# EAGLE design G888 (EAGLE 4.11)
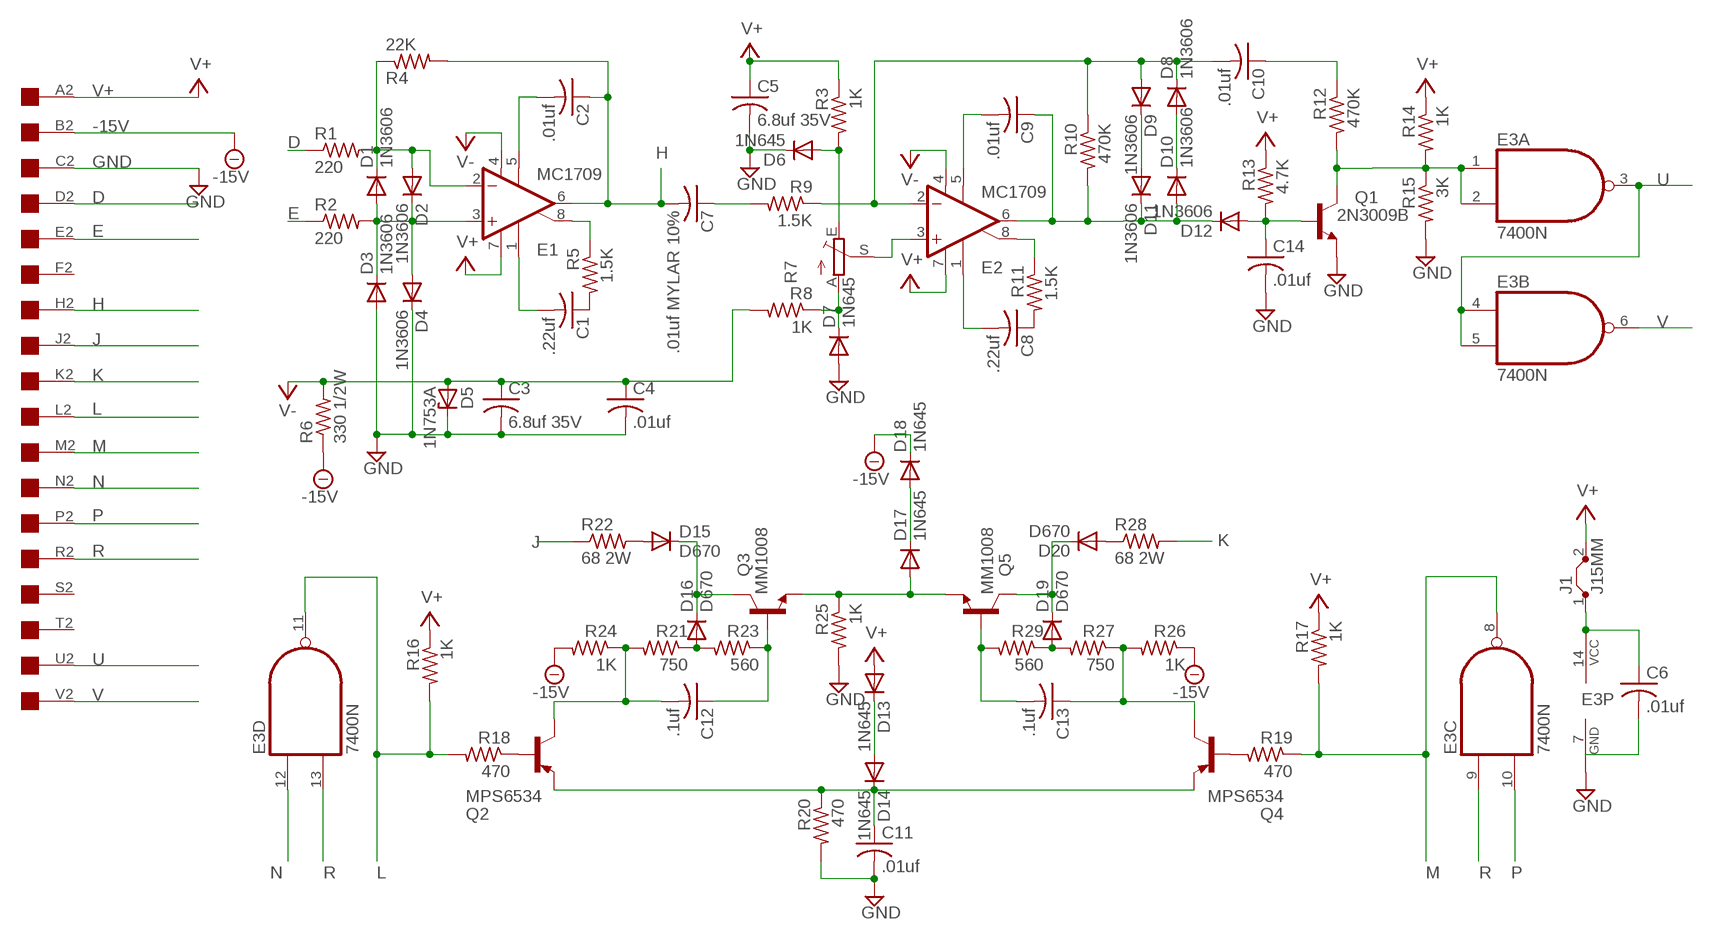
[diagram p0: schematic, sheet 1]

## Parts
C1  .22uf  C-US050-025X075  [C050-025X075]
C2  .01uf  C-US050-025X075  [C050-025X075]
C3  6.8uf 35V  C-US102-043X133  [C102-043X133]
C4  .01uf  C-US050-025X075  [C050-025X075]
C5  6.8uf 35V  C-US102-043X133  [C102-043X133]
C6  .01uf  C-US050-025X075  [C050-025X075]
C7  .01uf MYLAR 10%  C-US050-025X075  [C050-025X075]
C8  .22uf  C-US050-025X075  [C050-025X075]
C9  .01uf  C-US050-025X075  [C050-025X075]
C10  .01uf  C-US050-025X075  [C050-025X075]
C11  .01uf  C-US050-025X075  [C050-025X075]
C12  .1uf  C-US050-025X075  [C050-025X075]
C13  .1uf  C-US050-025X075  [C050-025X075]
C14  .01uf  C-US050-025X075  [C050-025X075]
D1  1N3606  1N4004  [DO41-10]
D2  1N3606  1N4004  [DO41-10]
D3  1N3606  1N4004  [DO41-10]
D4  1N3606  1N4004  [DO41-10]
D5  1N753A  ZENER-DIODEDO35Z10  [DO35Z10]
D6  1N645  1N4004  [DO41-10]
D7  1N645  1N4004  [DO41-10]
D8  1N3606  1N4004  [DO41-10]
D9  1N3606  1N4004  [DO41-10]
D10  1N3606  1N4004  [DO41-10]
D11  1N3606  1N4004  [DO41-10]
D12  1N3606  1N4004  [DO41-10]
D13  1N645  1N4004  [DO41-10]
D14  1N645  1N4004  [DO41-10]
D15  D670  1N4004  [DO41-10]
D16  D670  1N4004  [DO41-10]
D17  1N645  1N4004  [DO41-10]
D18  1N645  1N4004  [DO41-10]
D19  D670  1N4004  [DO41-10]
D20  D670  1N4004  [DO41-10]
E1  MC1709  LM3080N  [DIL08]
E2  MC1709  LM3080N  [DIL08]
E3  7400N  [DIL14]
J1  J15MM  [15]
Q1  2N3009B  -NPN-TO92  [TO92]
Q2  MPS6534  2N3906  [TO92]
Q3  MM1008  -NPN-TO92  [TO92]
Q4  MPS6534  2N3906  [TO92]
Q5  MM1008  -NPN-TO92  [TO92]
R1  220  R-US_0207/10  [0207/10]
R2  220  R-US_0207/10  [0207/10]
R3  1K  R-US_0207/10  [0207/10]
R4  22K  R-US_0207/10  [0207/10]
R5  1.5K  R-US_0207/10  [0207/10]
R6  330 1/2W  R-US_0411/15  [0411/15]
R7  TRIM_EU-PTSPIN  [PT-SPIN]
R8  1K  R-US_0207/10  [0207/10]
R9  1.5K  R-US_0207/10  [0207/10]
R10  470K  R-US_0207/10  [0207/10]
R11  1.5K  R-US_0207/10  [0207/10]
R12  470K  R-US_0207/10  [0207/10]
R13  4.7K  R-US_0207/10  [0207/10]
R14  1K  R-US_0207/10  [0207/10]
R15  3K  R-US_0207/10  [0207/10]
R16  1K  R-US_0207/10  [0207/10]
R17  1K  R-US_0207/10  [0207/10]
R18  470  R-US_0207/10  [0207/10]
R19  470  R-US_0207/10  [0207/10]
R20  470  R-US_0207/10  [0207/10]
R21  750  R-US_0207/10  [0207/10]
R22  68 2W  R-US_0922/22  [0922/22]
R23  560  R-US_0207/10  [0207/10]
R24  1K  R-US_0207/10  [0207/10]
R25  1K  R-US_0207/10  [0207/10]
R26  1K  R-US_0207/10  [0207/10]
R27  750  R-US_0207/10  [0207/10]
R28  68 2W  R-US_0922/22  [0922/22]
R29  560  R-US_0207/10  [0207/10]
U$5  ONE-SIDED  [ONE-SIDED]

## Nets
-15V: D18.C R6.1 R24.2 R26.1 U$5.B2
D: R1.1 U$5.D2
E: R2.1 U$5.E2
GND: C3.2 C4.2 C5.2 C11.2 C14.2 D3.A D4.C D5.C D6.C D7.A E3.7(P:GND) Q1.1(E) R15.2 R20.2 R25.2 U$5.C2
H: C2.1 C7.2 E1.6(OUT) R4.2 U$5.H2
J: R22.1 U$5.J2
K: R28.2 U$5.K2
L: E3.11(D:O) R16.2 R18.2 U$5.L2
M: E3.8(C:O) R17.2 R19.1 U$5.M2
N: E3.12(D:I0) U$5.N2
N$1: C1.1 R5.2
N$2: C8.1 R11.2
N$3: D1.C D2.A E1.2(-IN) R1.2 R4.1
N$4: D1.A D2.C D3.C D4.A E1.3(+IN) R2.2
N$5: C8.2 E2.1(ON1)
N$6: C1.2 E1.1(ON1)
N$7: E1.8(ON2) R5.1
N$8: C2.2 E1.5(OPT)
N$9: D6.A R3.2 R7.E
N$10: C10.2 D8.C D9.A E2.2(-IN) R9.1 R10.1
N$11: E2.3(+IN) R7.S
N$12: D7.C R7.A R8.1
N$13: E2.8(ON2) R11.1
N$14: C9.2 E2.5(OPT)
N$15: C9.1 D10.A D11.C D12.C E2.6(OUT) R10.2
N$16: C7.1 R9.2
N$17: D9.C D11.A
N$18: D8.A D10.C
N$19: C10.1 R12.1
N$20: C14.1 D12.A Q1.2(B) R13.2
N$21: E3.1(A:I0) E3.2(A:I1) Q1.3(C) R12.2 R14.2 R15.1
N$22: D17.A Q3.1(E) Q5.1(E) R25.1
N$23: C11.1 D14.C Q2.3(E) Q4.3(E) R20.1
N$24: D13.C D14.A
N$25: Q2.2(B) R18.1
N$26: Q4.2(B) R19.2
N$27: D15.A R22.2
N$28: D16.A R21.1 R23.2
N$29: C12.2 Q2.1(C) R21.2 R24.1
N$30: C12.1 Q3.2(B) R23.1
N$31: D19.A R27.2 R29.1
N$32: C13.1 Q4.1(C) R26.2 R27.1
N$33: C13.2 Q5.2(B) R29.2
N$34: D20.A R28.1
N$35: D15.C D16.C Q3.3(C)
N$36: D19.C D20.C Q5.3(C)
N$37: D17.C D18.A
N$38: C6.2
P: E3.10(C:I1) U$5.P2
R: E3.9(C:I0) E3.13(D:I1) U$5.R2
U: E3.3(A:O) E3.4(B:I0) E3.5(B:I1) U$5.U2
V: E3.6(B:O) U$5.V2
V+: C5.1 D13.A E1.7(V+) E2.7(V+) J1.2 R3.1 R13.1 R14.1 R16.1 R17.1 U$5.A2
V-: C3.1 C4.1 D5.A E1.4(V-) E2.4(V-) R6.2 R8.2
VCC: C6.1 E3.14(P:VCC) J1.1
Unconnected: U$5.F2 U$5.S2 U$5.T2

## Library data of the parts
C1-C14 = rcl:C-US: CAPACITOR, American symbol
D1-D4 D6-D20 = diode:1N4004: DIODE general purpose rectifier, 1 A
D5 = diode:ZENER-DIODE: Z-Diode
E1 E2 = linear:*3080: OP AMP
E3 = 74xx-us:74*00: Quad 2-input NAND gate
J1 = jumper:J: Bridge
Q1 Q3 Q5 = transistor:*-NPN-: NPN Transistror
Q2 Q4 = transistor-pnp:2N3906: PNP Transistor
R1-R6 R8-R29 = rcl:R-US_: RESISTOR, American symbol
R7 = pot:TRIM_EU-: POTENTIOMETER
U$5 = con-dec:ONE-SIDED: One-sided DEC Flip-Chip single card fingers

## Board
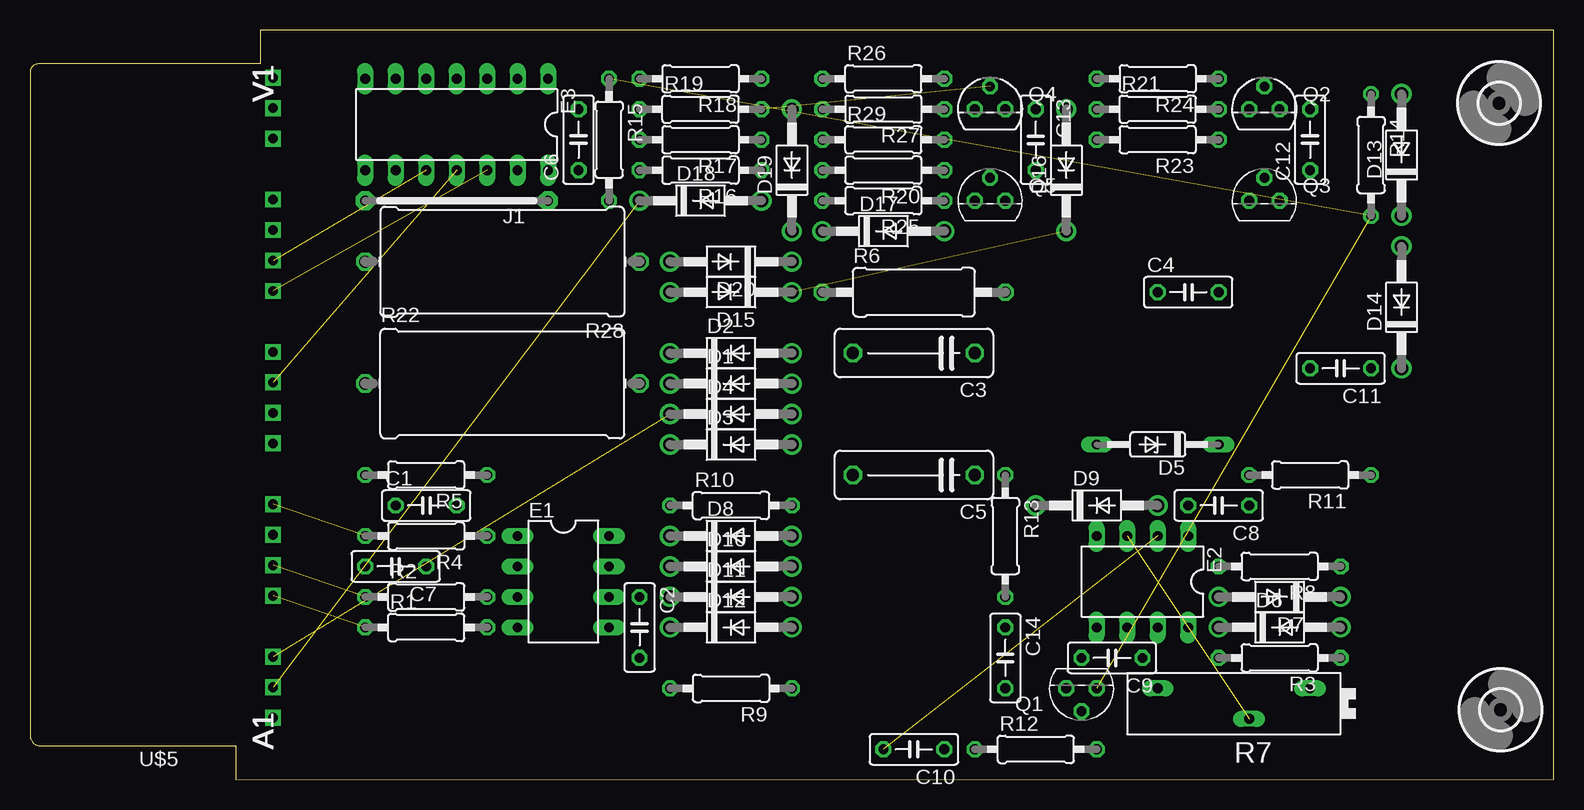
[diagram p1: board, top side]
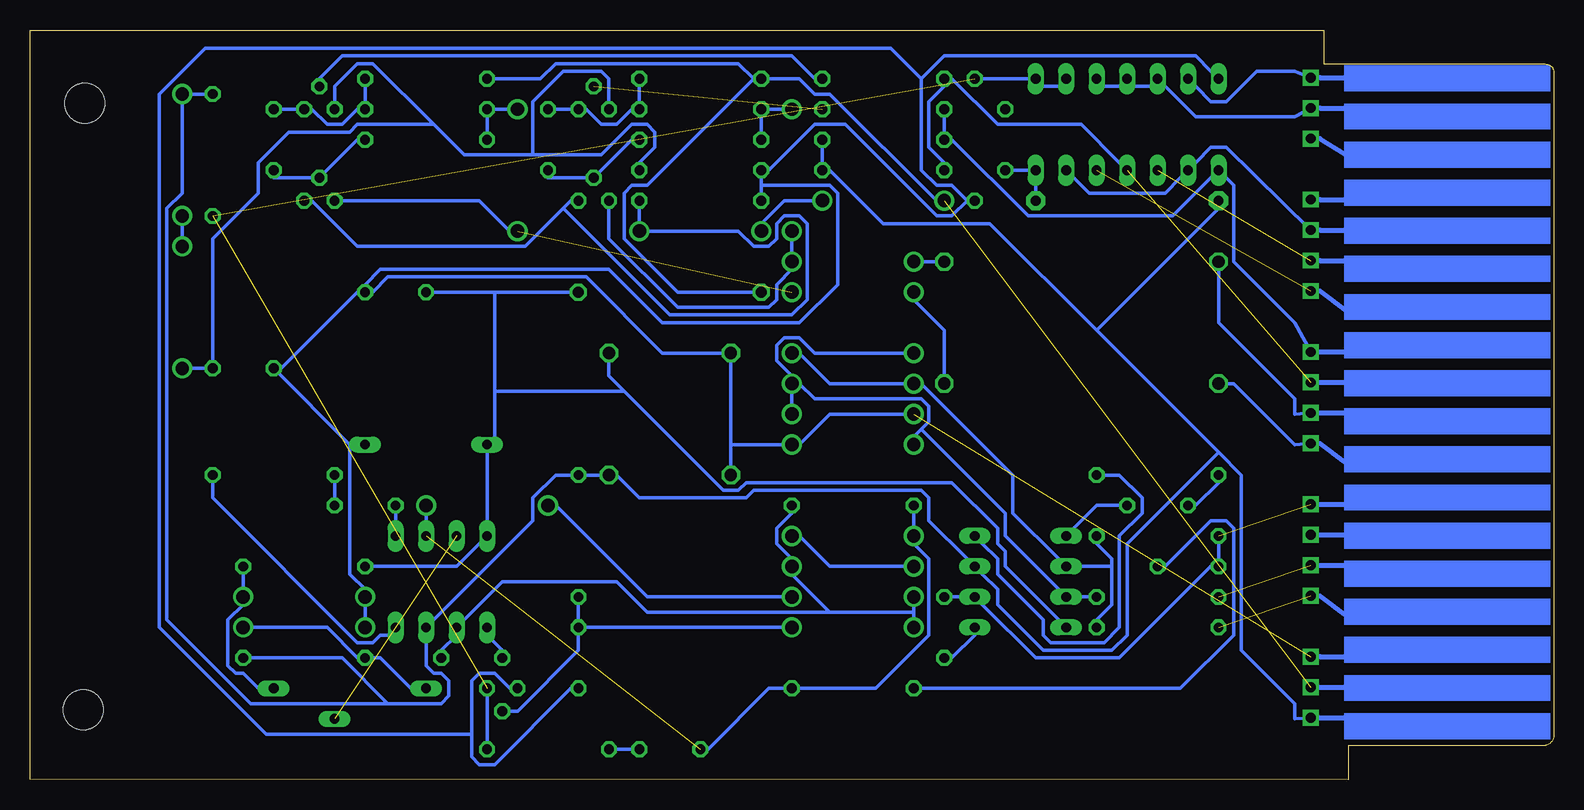
[diagram p2: board, bottom side, seen from below]

Size 126.98 x 62.48 mm. Coordinates in mm from the lower left corner, seen from the top.
Outline: 17.14,2.83 17.14,0 126.98,0.04 126.98,62.45 19.17,62.48 19.17,59.65 0.69,59.65 arc90 0,58.96 0,3.72 arc90 0.89,2.83 17.14,2.83
Copper layers (1*16): Top 0.035mm / dielectric 1.5mm / Bottom 0.035mm
Design rules "10mils": minimum track width 12mil, minimum drill 28mil, track to track 10mil, track to pad 10mil, pad to pad 10mil, via to via 10mil, smd to smd 10mil, copper to edge 40mil, drill to drill 10mil, minimum pad ring 10mil, minimum via ring 8mil, stop-mask expansion 0mil, vias tented up to drill 0mil, thermal gap 10mil

### Footprints (pad centres in the part's own frame; a part is rotated, then mirrored left to right if it is on the bottom)
C050-025X075 = drill 0.813 octagon: 1 -2.54,0; 2 2.54,0
C102-043X133 = drill 1.016 octagon: 1 -5.08,0; 2 5.08,0
DO41-10 = drill 1.118 round: A 5.08,0; C -5.08,0
DO35Z10 = drill 0.813 long: A 5.08,0; C -5.08,0
DIL08 = drill 0.813 long: 1 -3.81,-3.81; 2 -1.27,-3.81; 3 1.27,-3.81; 4 3.81,-3.81; 5 3.81,3.81; 6 1.27,3.81; 7 -1.27,3.81; 8 -3.81,3.81
DIL14 = drill 0.813 long: 1 -7.62,-3.81; 2 -5.08,-3.81; 3 -2.54,-3.81; 4 0,-3.81; 5 2.54,-3.81; 6 5.08,-3.81; 7 7.62,-3.81; 8 7.62,3.81; 9 5.08,3.81; 10 2.54,3.81; 11 0,3.81; 12 -2.54,3.81; 13 -5.08,3.81; 14 -7.62,3.81
15 = drill 0.813 pad 1.6 octagon: 1 -7.62,0; 2 7.62,0
TO92 = drill 0.813 octagon: 1 1.27,0; 2 0,1.905; 3 -1.27,0
0207/10 = drill 0.813 octagon: 1 -5.08,0; 2 5.08,0
0411/15 = drill 0.914 octagon: 1 -7.62,0; 2 7.62,0
PT-SPIN = drill 0.813 long: A -6.35,-1.27; E 6.35,-1.27; S -1.27,1.27
0922/22 = drill 1.016 octagon: 1 -11.43,0; 2 11.43,0
3,3 = hole 3.3: 0,0
ONE-SIDED = drill 0.813 square: A2 20.256,5.175; B2 20.256,7.715; C2 20.256,10.255; D2 20.256,15.335; E2 20.256,17.875; F2 20.256,20.415; H2 20.256,22.955; J2 20.256,28.035; K2 20.256,30.575; L2 20.256,33.115; M2 20.256,35.655; N2 20.256,40.735; P2 20.256,43.275; R2 20.256,45.815; S2 20.256,48.355; T2 20.256,53.435; U2 20.256,55.975; V2 20.256,58.515

### Placement (x,y rotation side)
C1  33.02,22.86 0 top
C2  50.79,12.7 270 top
C3  73.66,35.56 180 top
C4  96.52,40.64 0 top
C5  73.66,25.4 180 top
C6  45.71,53.34 90 top
C7  30.48,17.78 180 top
C8  99.06,22.86 180 top
C9  90.17,10.16 180 top
C10  73.66,2.54 180 top
C11  109.22,34.29 180 top
C12  106.68,53.34 90 top
C13  83.81,53.34 270 top
C14  81.28,10.16 270 top
D1  58.41,33.02 0 top
D2  58.41,35.56 0 top
D3  58.41,27.94 0 top
D4  58.41,30.48 0 top
D5  93.98,27.94 180 top
D6  104.14,12.7 0 top
D7  104.14,15.24 180 top
D8  58.41,20.32 0 top
D9  88.9,22.86 0 top
D10  58.41,17.78 0 top
D11  58.41,15.24 0 top
D12  58.41,12.7 0 top
D13  114.3,52.07 90 top
D14  114.3,39.37 90 top
D15  58.41,40.64 180 top
D16  86.36,50.8 90 top
D17  71.12,45.72 0 top
D18  55.88,48.26 0 top
D19  63.49,50.8 90 top
D20  58.41,43.18 180 top
E1  44.45,16.51 270 top
E2  92.7,16.51 180 top
E3  35.55,54.61 180 top
J1  35.55,48.26 180 top
Q1  87.62,7.62 180 top
Q2  102.87,55.88 0 top
Q3  102.87,48.26 0 top
Q4  80.01,55.88 0 top
Q5  80.01,48.26 0 top
R1  33.02,12.7 0 top
R2  33.02,15.24 0 top
R3  104.14,10.16 180 top
R4  33.02,20.32 180 top
R5  33.02,25.4 180 top
R6  73.66,40.64 0 top
R7  100.33,6.35 180 top
R8  104.14,17.78 180 top
R9  58.41,7.62 180 top
R10  58.41,22.86 0 top
R11  106.68,25.4 180 top
R12  83.81,2.54 0 top
R13  81.28,20.32 270 top
R14  111.76,52.07 270 top
R15  48.25,53.34 270 top
R16  55.88,50.8 180 top
R17  55.88,53.34 180 top
R18  55.88,58.42 180 top
R19  55.88,55.88 0 top
R20  71.12,50.8 180 top
R21  93.98,55.88 0 top
R22  39.36,33.02 0 top
R23  93.98,53.34 180 top
R24  93.98,58.42 180 top
R25  71.12,48.26 180 top
R26  71.12,58.42 0 top
R27  71.12,55.88 180 top
R28  39.36,43.18 180 top
R29  71.12,53.34 0 top
U$2  [3,3]  122.42,56.39 0 top
U$3  [3,3]  122.55,5.84 0 top
U$5  -0.01,0 0 top

### Tracks (layer width: path | path; a pad name or v marks a point on that pad's centre or on a via)
-15V  (1 unrouted)
  Bottom 0.305: R26.1 65.4,58.42 62.86,58.42 61.59,57.15 60.32,57.15 51.43,48.26 D18.C | 66.67,58.42 67.94,59.69 83.18,59.69 84.45,58.42 88.26,58.42 R24.2 | R26.1 66.67,58.42 | 66.67,58.42 75.56,49.53 76.83,49.53 77.47,48.9 77.47,45.09 73.02,40.64 66.67,40.64 R6.1 | R26.1 66.67,58.42
D  (1 unrouted)
E  (1 unrouted)
GND  (1 unrouted)
  Bottom 0.305: 66.04,49.53 66.04,48.9 R25.2 | 66.04,49.53 66.04,50.16 R20.2 65.4,50.8 61.59,54.61 59.05,54.61 51.43,46.99 50.16,46.99 48.89,48.26 | 68.58,27.94 68.58,34.92 C3.2 69.21,35.56 74.29,35.56 80.64,41.91 97.15,41.91 98.42,40.64 C4.2 | 68.58,27.94 68.58,26.04 C5.2 | 68.58,27.94 64.13,27.94 D3.A 62.86,27.94 60.32,30.48 53.97,30.48 D4.C | D6.C 99.06,13.34 99.06,14.61 D7.A 99.06,15.88 100.33,17.14 100.33,27.94 | 100.33,27.94 C11.2 106.04,34.29 99.69,40.64 C4.2 | 100.33,27.94 D5.C 100.33,27.94 | 90.17,3.81 90.17,8.26 89.53,8.89 88.26,8.89 86.99,7.62 Q1.1 | 90.17,3.81 90.17,1.91 89.53,1.27 88.26,1.27 81.91,7.62 C14.2 | 52.7,58.42 50.79,60.33 29.84,60.33 28.57,59.05 E3.7 | 52.7,58.42 52.7,50.8 51.43,49.53 50.16,49.53 48.89,48.26 | 48.89,48.26 R15.2 48.89,48.26 | 90.17,3.81 107.31,3.81 116.2,12.7 116.2,57.15 112.39,60.96 55.24,60.96 52.7,58.42 | 66.04,49.53 60.32,49.53 59.68,48.9 59.68,41.27 62.86,38.1 74.29,38.1 78.73,42.55 97.79,42.55 99.06,41.27 C4.2
H  (1 unrouted)
  Bottom 0.305: R4.2 27.94,19.68 27.94,18.41 C7.2 28.57,17.78 36.19,10.16 43.17,10.16 47.62,14.61 E1.6 49.52,15.24 50.16,15.24 C2.1
J
  Bottom 0.305: U$5.J2 21.59,27.94 26.67,33.02 27.3,33.02 R22.1
K
  Bottom 0.305: U$5.K2 21.59,30.48 21.59,31.75 27.94,38.1 27.94,42.55 R28.2
L  (1 unrouted)
  Bottom 0.305: E3.11 36.19,51.44 39.36,54.61 46.35,54.61 50.16,58.42 R18.2 50.79,57.78 52.06,56.52 52.06,52.7 50.79,51.44 R16.2
M
  Bottom 0.305: R19.1 50.79,55.24 50.79,53.98 R17.2 50.16,53.34 43.81,46.99 31.75,46.99 28.57,50.16 E3.8 27.3,50.16 26.67,49.53 26.67,43.18 21.59,38.1 U$5.M2
N  (1 unrouted)
N$1
  Bottom 0.305: C1.1 29.84,22.86 27.94,24.77 R5.2
N$2
  Bottom 0.305: C8.1 101.59,23.5 101.59,24.77 R11.2
N$3
  Bottom 0.305: 36.82,17.78 36.82,18.41 38.09,19.68 R4.1 | 36.82,17.78 36.82,14.61 38.09,13.34 R1.2 | 36.82,17.78 39.36,17.78 E1.2 41.27,18.41 45.08,22.23 45.08,25.4 52.7,33.02 D1.C 53.97,33.02 60.32,33.02 62.86,35.56 D2.A
N$4
  Bottom 0.305: R2.2 38.73,15.24 39.36,15.24 E1.3 41.27,15.88 45.71,20.32 45.71,22.23 52.7,29.21 | 52.7,29.21 52.06,29.84 52.06,31.11 52.7,31.75 61.59,31.75 62.86,33.02 D1.A | 52.7,29.21 53.34,28.57 D3.C | D2.C 53.97,35.56 61.59,35.56 62.86,36.83 64.13,36.83 64.77,36.2 64.77,34.92 63.49,33.66 D1.A | D4.A 63.49,31.11 63.49,32.38 D1.A
N$5
  Bottom 0.305: E2.1 96.52,21.59 96.52,22.23 C8.2
N$6
  Bottom 0.305: C1.2 36.19,22.86 38.09,22.86 40,20.95 E1.1
N$7
  Bottom 0.305: E1.8 47.62,19.68 46.35,18.41 46.35,17.14 42.54,13.34 42.54,12.06 41.9,11.43 37.46,11.43 36.19,12.7 36.19,20.32 34.28,22.23 34.28,23.5 36.19,25.4 37.46,25.4 R5.1
N$8
  Bottom 0.305: C2.2 50.16,10.16 48.25,12.06 E1.5
N$9
  Bottom 0.305: R7.E 95.25,7.62 97.79,10.16 98.42,10.16 R3.2 99.69,10.16 102.23,12.7 108.58,12.7 D6.A
N$10  (1 unrouted)
  Bottom 0.305: R10.1 53.34,22.23 53.34,20.95 D8.C 53.34,19.68 52.06,18.41 52.06,12.06 56.51,7.62 62.86,7.62 R9.1 64.13,7.62 65.4,7.62 70.48,2.54 C10.2 | E2.2 93.98,21.59 93.98,22.23 D9.A
N$11  (1 unrouted)
N$12
  Bottom 0.305: R7.A 107.95,7.62 109.22,8.89 109.85,8.89 110.48,9.53 110.48,13.34 109.22,14.61 D7.C 109.22,15.88 109.22,17.14 R8.1
N$13
  Bottom 0.305: E2.8 97.15,12.06 97.79,12.06 98.42,11.43 99.69,11.43 111.76,23.5 111.76,24.77 R11.1
N$14
  Bottom 0.305: C9.2 87.62,10.79 88.9,12.06 E2.5
N$15
  Bottom 0.305: R10.2 63.49,22.23 64.77,20.95 64.77,19.68 63.49,18.41 D10.A 63.49,17.14 60.32,13.97 | C9.1 92.7,10.79 91.44,12.06 E2.6 90.8,13.34 87.62,16.51 78.1,16.51 75.56,13.97 60.32,13.97 | 53.34,13.97 53.34,14.61 D11.C | 53.34,13.97 53.34,13.34 D12.C | 53.34,13.97 60.32,13.97
N$16
  Bottom 0.305: C7.1 32.38,17.78 28.57,21.59 27.3,21.59 26.67,20.95 26.67,12.06 31.11,7.62 52.7,7.62 R9.2
N$17
  Bottom 0.305: D11.A 64.13,15.24 75.56,15.24 83.18,22.86 D9.C
N$18
  Bottom 0.305: D10.C 53.97,17.78 60.32,17.78 62.86,20.32 D8.A
N$19
  Bottom 0.305: C10.1 76.83,2.54 78.1,2.54 R12.1
N$20
  Bottom 0.305: C14.1 81.28,13.34 81.28,14.61 R13.2 | Q1.2 86.99,5.71 86.36,5.71 81.28,10.79 81.28,12.06 C14.1 | D12.A 64.13,12.7 80.64,12.7 C14.1
N$21  (2 unrouted)
  Bottom 0.305: E3.2 41.27,57.78 42.54,57.78 E3.1 43.81,58.42 47.62,58.42 R15.1 | R12.2 88.9,3.17 88.9,6.99 Q1.3
N$22
  Bottom 0.305: R25.1 76.2,47.62 76.2,46.35 D17.A 75.56,45.72 67.94,45.72 66.67,44.45 65.4,44.45 64.77,45.09 64.77,46.35 64.13,46.99 62.86,46.99 62.22,46.35 62.22,40.01 63.49,38.73 73.66,38.73 82.55,47.62 | 82.55,47.62 85.72,44.45 99.69,44.45 103.5,48.26 Q3.1 | 82.55,47.62 81.91,48.26 Q5.1
N$23
  Bottom 0.305: D14.C 113.66,34.29 112.39,34.29 C11.1 111.76,34.92 111.76,45.09 107.95,48.9 107.95,51.44 105.41,53.98 100.33,53.98 99.69,54.61 93.34,54.61 | 85.09,52.07 90.8,52.07 93.34,54.61 | 85.09,52.07 79.37,52.07 76.83,54.61 75.56,54.61 74.93,53.98 74.93,52.7 76.2,51.44 R20.1 | 93.34,54.61 98.42,59.69 99.69,59.69 101.59,57.78 101.59,56.52 Q2.3 | 85.09,52.07 85.09,56.52 82.55,59.05 79.37,59.05 78.73,58.42 78.73,56.52 Q4.3
N$24
  Bottom 0.305: D14.A 114.3,45.09 114.3,46.35 D13.C
N$25
  Bottom 0.305: R18.1 61.59,58.42 63.49,60.33 100.96,60.33 102.87,58.42 Q2.2
N$26  (1 unrouted)
N$27
  Bottom 0.305: R22.2 50.79,33.66 50.79,37.47 53.34,40.01 D15.A
N$28
  Bottom 0.305: R23.2 88.9,53.98 88.9,55.24 R21.1 88.26,55.88 86.99,55.88 D16.A
N$29
  Bottom 0.305: R24.1 99.06,57.78 99.06,56.52 R21.2 99.69,55.88 100.96,54.61 102.23,54.61 103.5,55.88 Q2.1 104.77,55.88 106.04,55.88 C12.2
N$30
  Bottom 0.305: C12.1 106.68,50.16 103.5,50.16 Q3.2 99.69,53.34 R23.1
N$31
  Bottom 0.305: R29.1 66.04,53.98 66.04,55.24 R27.2 65.4,55.88 64.13,55.88 D19.A
N$32
  Bottom 0.305: R26.2 76.2,57.78 76.2,56.52 R27.1 76.83,55.88 78.1,54.61 79.37,54.61 80.64,55.88 Q4.1 81.91,55.88 83.18,55.88 C13.1
N$33
  Bottom 0.305: C13.2 83.81,50.16 80.64,50.16 Q5.2 76.83,53.34 R29.2
N$34
  Bottom 0.305: R28.1 51.43,43.18 52.7,43.18 D20.A
N$35  (1 unrouted)
  Bottom 0.305: Q3.3 100.96,48.26 89.53,48.26 86.99,45.72 D16.C
N$36
  Bottom 0.305: Q5.3 78.73,47.62 78.73,45.09 73.02,39.37 65.4,39.37 64.77,40.01 64.77,41.27 63.49,42.55 D20.C 63.49,43.81 63.49,45.09 D19.C
N$37
  Bottom 0.305: D18.A 61.59,48.26 64.13,48.26 66.04,46.35 D17.C
P  (1 unrouted)
R
  Bottom 0.305: E3.13 40,50.16 38.73,48.9 32.38,48.9 31.11,50.16 E3.9 29.84,51.44 28.57,52.7 27.3,52.7 U$5.R2
U
  Bottom 0.305: E3.3 37.46,57.78 36.19,57.78 E3.4 34.92,57.78 33.65,57.78 E3.5 32.38,57.78 29.84,55.24 21.59,55.24 U$5.U2
V
  Bottom 0.305: U$5.V2 21.59,59.05 24.76,59.05 27.3,56.52 28.57,56.52 29.84,57.78 E3.6
V+
  Bottom 0.305: 27.94,27.3 38.09,37.47 | 38.09,37.47 46.98,46.35 55.88,46.35 60.32,50.8 R16.1 60.95,51.44 60.95,52.7 R17.1 | 27.94,27.3 26.03,25.4 26.03,10.79 21.59,6.35 21.59,5.08 U$5.A2 | R14.1 112.39,57.15 113.66,57.15 D13.A 114.3,56.52 114.3,48.9 115.56,47.62 115.56,13.34 108.58,6.35 97.15,6.35 | 97.15,6.35 100.96,10.16 108.58,10.16 R3.1 | 97.15,6.35 92.7,6.35 92.07,6.99 92.07,8.26 92.7,8.89 93.34,8.89 93.98,9.53 93.98,11.43 E2.7 93.34,13.34 85.09,21.59 85.09,23.5 83.18,25.4 81.91,25.4 R13.1 80.64,25.4 79.37,25.4 C5.1 78.1,25.4 76.2,23.5 67.31,23.5 66.67,24.13 52.7,24.13 52.06,23.5 52.06,21.59 48.89,18.41 E1.7 47.62,17.14 46.35,15.88 46.35,14.61 42.54,10.79 36.82,10.79 35.55,12.06 35.55,19.68 27.94,27.3 | 38.09,37.47 27.94,47.62 J1.2
V-
  Bottom 0.305: 88.26,40.64 81.91,40.64 R6.2 | 88.26,40.64 93.34,40.64 C4.1 | R8.2 98.42,17.78 91.44,17.78 89.53,19.68 E2.4 88.9,21.59 88.9,27.3 D5.A 88.26,28.57 88.26,32.38 | 88.26,32.38 88.26,40.64 | 77.47,32.38 78.73,33.66 78.73,34.92 C3.1 | 77.47,32.38 69.21,24.13 67.94,24.13 67.31,24.77 50.16,24.77 46.35,20.95 46.35,19.68 45.71,19.05 45.71,17.78 41.27,13.34 E1.4 | 77.47,32.38 88.26,32.38
VCC
  Bottom 0.305: J1.1 43.17,48.9 43.17,49.53 E3.14 43.81,50.8 45.08,50.8 C6.1

### Text on the board
tNames: V1 | V1 | V1 | V1 | V1 | V1 | V1 | V1 | V1 | V1 | V1 | V1 | V1 | V1 | V1 | V1 | V1 | V1 | V1 | V1 | V1 | V1 | V1 | V1 | V1 | V1 | V1 | V1 | V1 | V1 | V1 | V1 | A1 | A1 | A1 | A1 | A1 | A1 | A1 | A1 | A1 | A1 | A1 | A1 | A1 | A1 | A1 | A1 | A1 | A1 | A1 | A1 | A1 | A1 | A1 | A1 | A1 | A1 | A1 | A1 | A1 | A1 | A1 | A1